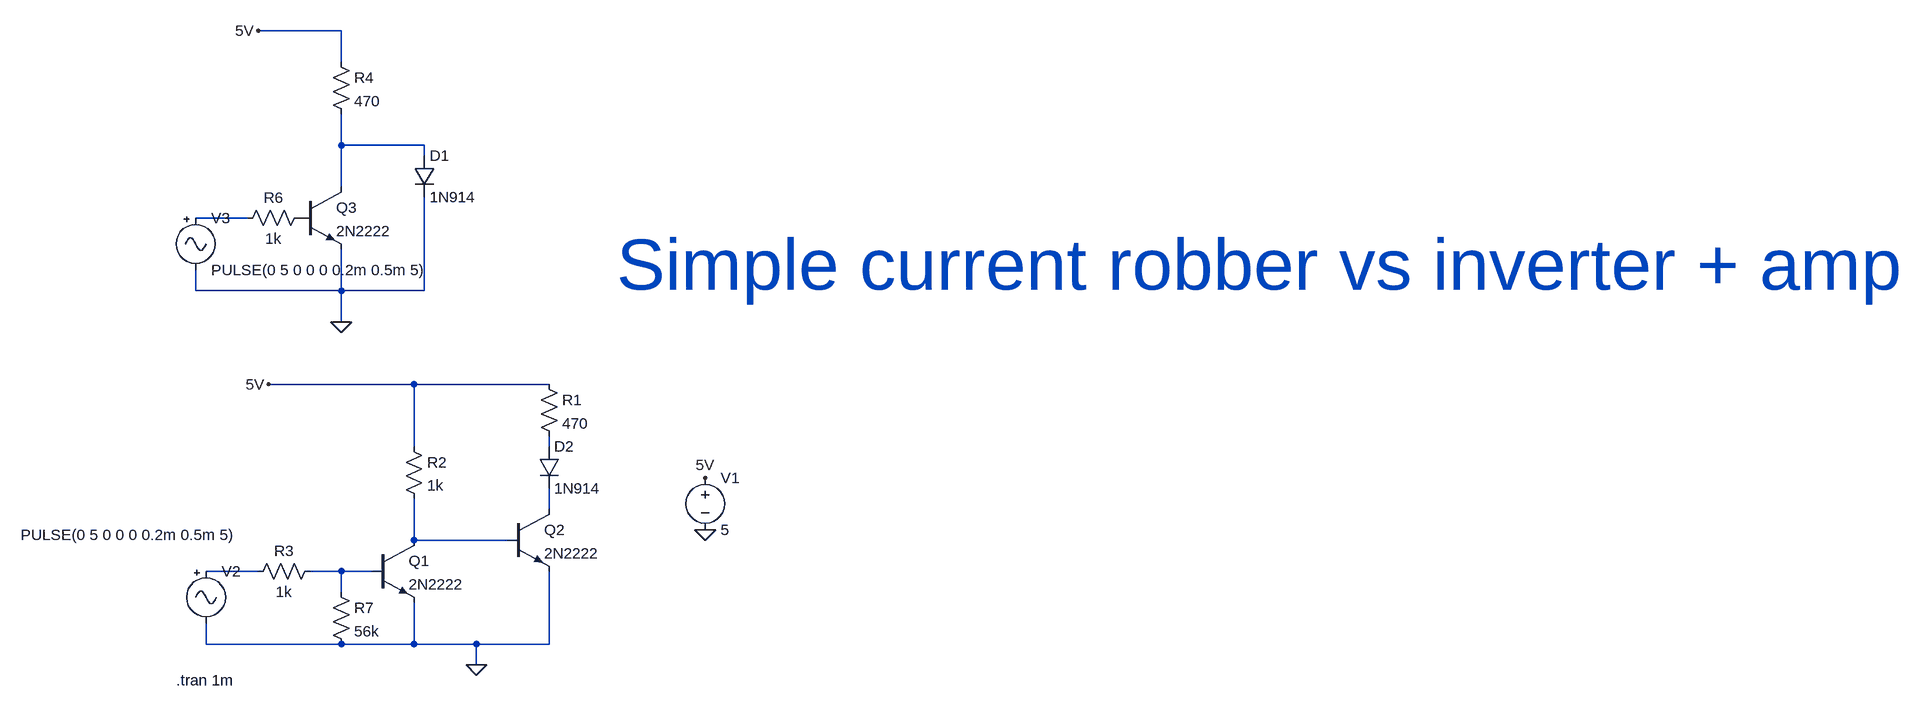
[diagram p0: schematic Current robber.asc]
Current robber.asc, the LTspice schematic file:
Version 4
SHEET 1 2688 680
WIRE 96 -688 -32 -688
WIRE 96 -640 96 -688
WIRE 96 -512 96 -560
WIRE 224 -512 96 -512
WIRE 224 -496 224 -512
WIRE 96 -448 96 -512
WIRE -48 -400 -128 -400
WIRE -128 -288 -128 -320
WIRE 96 -288 96 -352
WIRE 96 -288 -128 -288
WIRE 224 -288 224 -432
WIRE 224 -288 96 -288
WIRE 96 -240 96 -288
WIRE 208 -144 -16 -144
WIRE 416 -144 208 -144
WIRE 208 -48 208 -144
WIRE 416 -48 416 -64
WIRE 416 48 416 16
WIRE 208 96 208 32
WIRE 352 96 208 96
WIRE -32 144 -112 144
WIRE 96 144 48 144
WIRE 144 144 96 144
WIRE 96 176 96 144
WIRE -112 256 -112 224
WIRE 96 256 -112 256
WIRE 208 256 208 192
WIRE 208 256 96 256
WIRE 304 256 208 256
WIRE 416 256 416 144
WIRE 416 256 304 256
WIRE 304 288 304 256
FLAG 304 288 0
FLAG -16 -144 5V
FLAG 656 80 0
FLAG 656 0 5V
FLAG -32 -688 5V
FLAG 96 -240 0
SYMBOL npn 144 96 R0
SYMATTR InstName Q1
SYMATTR Value 2N2222
SYMBOL npn 352 48 R0
SYMATTR InstName Q2
SYMATTR Value 2N2222
SYMBOL res 400 -160 R0
SYMATTR InstName R1
SYMATTR Value 470
SYMBOL res 192 -64 R0
SYMATTR InstName R2
SYMATTR Value 1k
SYMBOL diode 400 -48 R0
SYMATTR InstName D2
SYMATTR Value 1N914
SYMATTR Description Light Emitting Diode
SYMATTR Type led
SYMBOL voltage 656 -16 R0
WINDOW 123 0 0 Left 0
WINDOW 39 0 0 Left 0
SYMATTR InstName V1
SYMATTR Value 5
SYMBOL res 64 128 R90
WINDOW 0 0 56 VBottom 2
WINDOW 3 32 56 VTop 2
SYMATTR InstName R3
SYMATTR Value 1k
SYMBOL Misc\\signal -112 128 R0
WINDOW 3 -285 -40 Left 2
WINDOW 123 0 0 Left 0
WINDOW 39 0 0 Left 0
SYMATTR InstName V2
SYMATTR Value PULSE(0 5 0 0 0 0.2m 0.5m 5)
SYMBOL npn 32 -448 R0
SYMATTR InstName Q3
SYMATTR Value 2N2222
SYMBOL res 80 -656 R0
SYMATTR InstName R4
SYMATTR Value 470
SYMBOL diode 208 -496 R0
SYMATTR InstName D1
SYMATTR Value 1N914
SYMATTR Description Light Emitting Diode
SYMATTR Type led
SYMBOL res 48 -416 R90
WINDOW 0 0 56 VBottom 2
WINDOW 3 32 56 VTop 2
SYMATTR InstName R6
SYMATTR Value 1k
SYMBOL Misc\\signal -128 -416 R0
WINDOW 123 0 0 Left 0
WINDOW 39 0 0 Left 0
SYMATTR InstName V3
SYMATTR Value PULSE(0 5 0 0 0 0.2m 0.5m 5)
SYMBOL res 80 160 R0
SYMATTR InstName R7
SYMATTR Value 56k
TEXT -158 312 Left 2 !.tran 1m
TEXT 520 -328 Left 7 ;Simple current robber vs inverter + amp

The netlist it stands for:
* Current robber.asc
Q1 N005 N007 0 0 2N2222
Q2 N004 N005 0 0 2N2222
R1 5V N003 470
R2 5V N005 1k
D2 N003 N004 1N914
V1 5V 0 5
R3 N007 N006 1k
V2 N006 0 PULSE(0 5 0 0 0 0.2m 0.5m 5)
Q3 N001 P001 0 0 2N2222
R4 5V N001 470
D1 N001 0 1N914
R6 P001 N002 1k
V3 N002 0 PULSE(0 5 0 0 0 0.2m 0.5m 5)
R7 N007 0 56k
.model D D
.lib standard.dio
.model NPN NPN
.model PNP PNP
.lib standard.bjt
.tran 1m
* Simple current robber vs inverter + amp
.backanno
.end